# Altium schematic sheet 遥控2.SchDoc
size A4; SheetNumber: 1; SheetTotal: 1
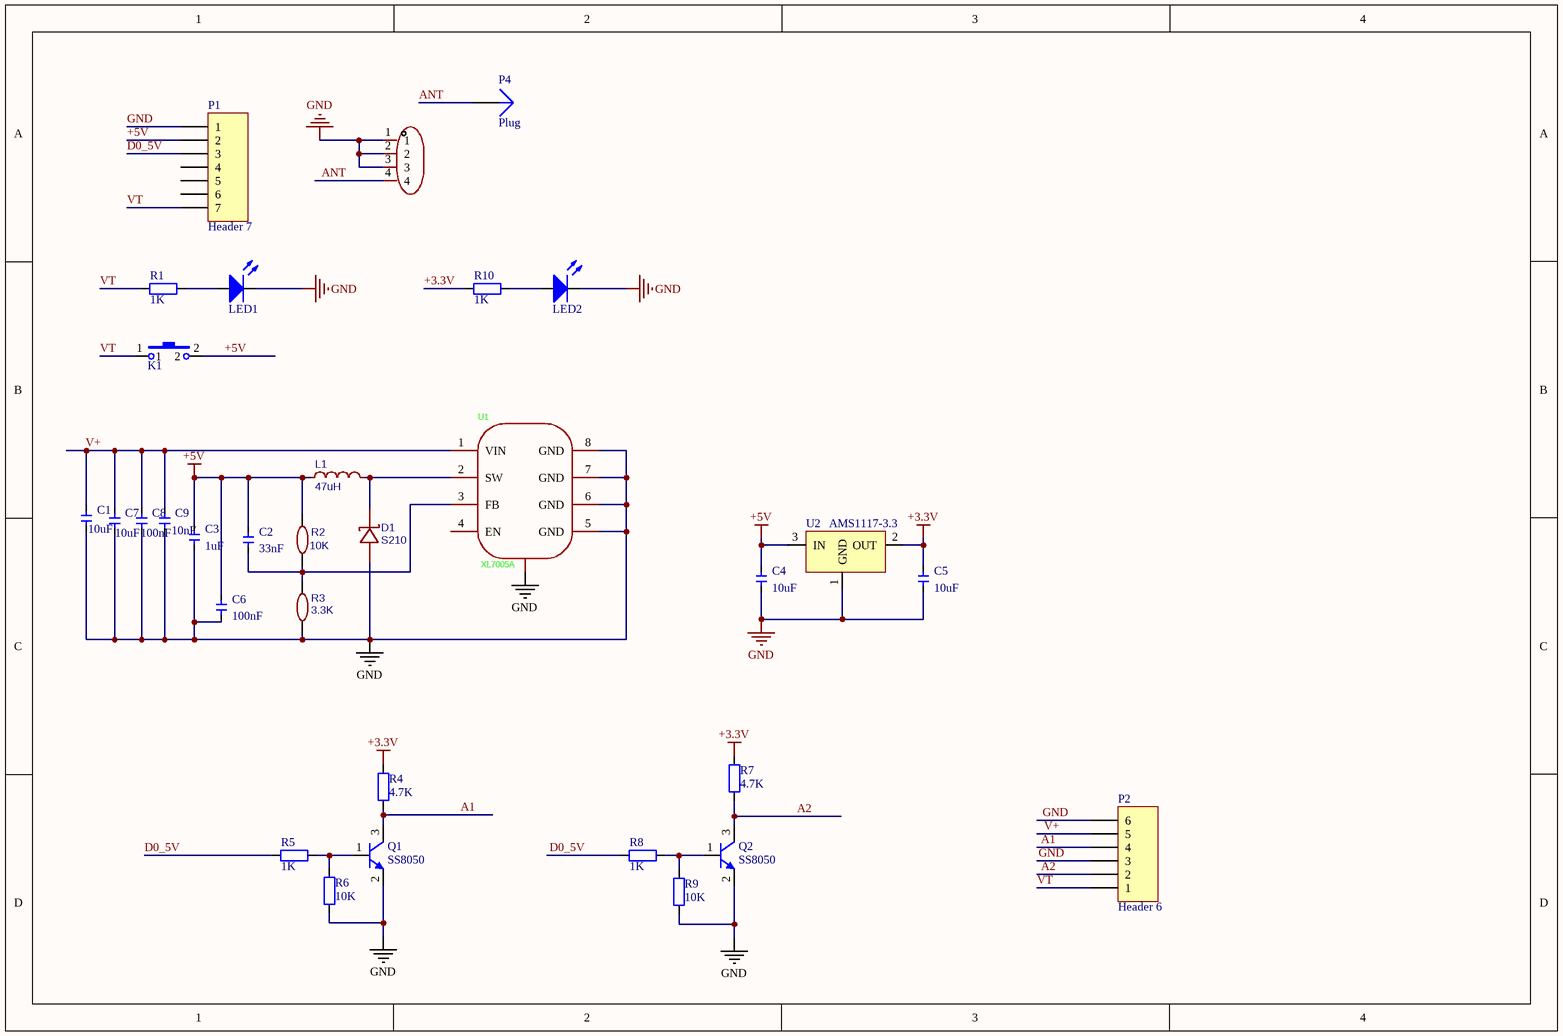
[diagram p0: 遥控2.SchDoc]

## Parts
C1  10uF  [0805]
C2  33nF  [CAP-0603]
C3  1uF  [CAP-0603]
C4  10uF  [CAP-0603]
C5  10uF  [CAP-0603]
C6  100nF  [CAP-0603]
C7  10uF  [0805]
C8  100nF  [0805]
C9  10nF  [0805]
D1  S210  [SOD-123]
K1  SW-PB  [SW-SMD_L3.9-W3.0-P4.45]  (value not drawn)
L1  47uH  [IND-SMD_L4.0-W4.0_FNR4012S]
LED1  LED  [LED_0805]  (value not drawn)
LED2  LED  [LED_0805]  (value not drawn)
P1  Header 7  [HDR1X7]
P2  Header 6  [HDR1X6]
P4  Plug  [HEADER_1]
Q1  SS8050  [SOT-23]
Q2  SS8050  [SOT-23]
R1  1K  [0603 - duplicate1]
R2  10K  [0603 - duplicate1]
R3  3.3K  [0603 - duplicate1]
R4  4.7K  [0603 - duplicate1]
R5  1K  [0603 - duplicate1]
R6  10K  [0603 - duplicate1]
R7  4.7K  [0603 - duplicate1]
R8  1K  [0603 - duplicate1]
R9  10K  [0603 - duplicate1]
R10  1K  [0603 - duplicate1]
RF1  6GHz  [CONN-SMD_GT-RF1125A-01G]  (value not drawn)
U1  XL7005A  [SOIC-8_L4.9-W3.9-P1.27-LS6.0-BL-EP3.1-1]
U2  AMS1117-3.3  [SOT89]

## Nets
+3.3V: C5.2 R4.1 R7.1 R10.2 U2.2(OUT)
+5V: C2.2 C3.2 C4.2 C6.2 K1.2 L1.1 P1.2 R2.2 U2.3(IN)
GND: C1.1 C3.1 C4.1 C5.1 C6.1 C7.1 C8.1 C9.1 D1.2(A) LED1.2(K) LED2.2(K) P1.1 P2.3 P2.6 Q1.2(E) Q2.2(E) R3.2 R6.1 R9.1 RF1.1 RF1.2 RF1.3 U1.5(GND) U1.6(GND) U1.7(GND) U1.8(GND) U1.9 U2.1(GND)
A1: P2.4 Q1.3(C) R4.2
A2: P2.2 Q2.3(C) R7.2
ANT: P4.1 RF1.4
D0_5V: P1.3 R5.1 R8.1
V+: C1.2 C7.2 C8.2 C9.2 P2.5 U1.1(VIN)
VT: K1.1 P1.7 P2.1 R1.2
NetC2_1: C2.1 R2.1 R3.1 U1.3(FB)
NetD1_1: D1.1(K) L1.2 U1.2(SW)
NetLED1_1: LED1.1(A) R1.1
NetLED2_1: LED2.1(A) R10.1
NetQ1_1: Q1.1(B) R5.2 R6.2
NetQ2_1: Q2.1(B) R8.2 R9.2

Not connected (* = marked no-connect by the designer): P1 4 5 6; U1 4(EN)

## Library data of the parts
C1-C9 = Cap: 无极性电容; Published: 8-Jun-2000; LatestRevisionDate: 17-Jul-2002; LatestRevisionNote: Re-released for DXP Platform.; PackageReference: RAD-0.3; Publisher: Altium Limited
D1 = B340A: Manufacturer: MDD; SMT Type: Extend; Supplier: LCSC; Manufacturer Part: B340A; image: //image.lceda.cn/szlcsc/C64982.jpg; Supplier Part: C64982; LCSC Assembly: Yes; spicePre: D; spiceSymbolName: B340A
K1 = SW-PB: 微动开关; Suppliter Part: C961737; Published: 24-Mar-1999; LatestRevisionDate: 17-Jul-2002; LatestRevisionNote: Re-released for DXP Platform.; PackageReference: SPST-2; Publisher: Altium Limited
L1 = 68uH: Manufacturer: SXN; Manufacturer Part: SMDRI127-680MT; nameAlias: Inductance; Supplier: LCSC; Supplier Part: C9907; spicePre: L; spiceSymbolName: SMDRI127-680MT
LED1 LED2 = LED: 发光二极管; Published: 8-Jun-2000; LatestRevisionDate: 08-Jul-2005; LatestRevisionNote: Mech Layer 1 removed.; PackageReference: LED-0; Publisher: Altium Limited
P1 = Header 7: Header, 7-Pin; LatestRevisionDate: 17-Jul-2002; LatestRevisionNote: Re-released for DXP Platform.; Publisher: Altium Limited
P2 = Header 6: Header, 6-Pin; LatestRevisionDate: 17-Jul-2002; LatestRevisionNote: Re-released for DXP Platform.; Publisher: Altium Limited
P4 = Plug: 安装孔; LatestRevisionDate: 17-Jul-2002; LatestRevisionNote: Re-released for DXP Platform.; Publisher: Altium Limited
Q1 Q2 = SS8050: NPN贴片三极管; Published: 8-Jun-2000; LatestRevisionDate: 15-Jan-2003; LatestRevisionNote: PCB Footprint 'BCY-W3/D4.7' replaced; DatasheetDocument: 1997; PackageDocument: Sep-1998; PackageReference: TO-92A; Publisher: Altium Limited; Code_JEDEC: TO-92A; ComponentLink1Description: Manufacturer Link; ComponentLink1URL: http://www.fairchildsemi.com/; ComponentLink2Description: Datasheet; ComponentLink2URL: http://www.fairchildsemi.com/ds/2N%2F2N3904.pdf
R1 R6 R9 R10 = Res: 贴片电阻; Published: 8-Jun-2000; LatestRevisionDate: 17-Jul-2002; LatestRevisionNote: Re-released for DXP Platform.; PackageReference: AXIAL-0.4; Publisher: Altium Limited
  R6 R9: Value: 10K
R2 = 1K: Manufacturer: UniOhm; Manufacturer Part: 0603WAF1001T5E; nameAlias: Resistance (Ohms); SMT Type: Basic; Supplier: LCSC; LCSC Assembly: Yes; Supplier Part: C21190; spicePre: R; spiceSymbolName: 0603WAF1001T5E
R3 = 3K: Manufacturer: UniOhm; Manufacturer Part: 0603WAF3001T5E; nameAlias: Resistance (Ohms); SMT Type: Basic; Supplier: LCSC; LCSC Assembly: Yes; Supplier Part: C4211; spicePre: R; spiceSymbolName: 0603WAF3001T5E
R4 R5 R7 R8 = Res: 贴片电阻; Value: 10K; Published: 8-Jun-2000; LatestRevisionDate: 17-Jul-2002; LatestRevisionNote: Re-released for DXP Platform.; PackageReference: AXIAL-0.4; Publisher: Altium Limited
RF1 = GT-RF1125A-01G: Manufacturer: G-Switch(品赞); Add into BOM: yes; Connector Type: 板端; Interface: 内针; Number of Ports: 1; Interface Diameter: 2mm; Interface Length/Height: 1.25mm; RF Series: IPEX; Impedance: 20mΩ; Style: 立贴; Symbol: GT-RF1125A-01G; Device: GT-RF1125A-01G; LCSC Part Name: 内针 IPEX 立贴; Supplier Part: C5299419; Manufacturer Part: GT-RF1125A-01G; Supplier Footprint: SMD; JLCPCB Part Class: Extended Part; Datasheet: https://atta.szlcsc.com/upload/public/pdf/source/20240806/E29158DC2BBCFBE0FBB4FF318E1913A6.pdf; Supplier: LCSC; Convert to PCB: yes; Value: 6GHz; Operating Temperature Range: -40℃~+90℃
U1 = XL7005A: Manufacturer: XLSEMI(芯龙); Add into BOM: yes; Function: 降压型; Output Type: 可调; Voltage - Supply: 5V~80V; Output Voltage: 1.25V~20V; Output Current: 400mA; Frequency - Switching: 150kHz; Synchronous Rectifier: 否; Number of Outputs: 1; Topology: 降压式; Quiescent Current: 2.5mA; Switch tube (built-in/external): 内置; Symbol: XL7005A; Device: XL7005A; LCSC Part Name: 0.4A 150kHz 80V 降压型DC-DC转换器; Supplier Part: C50848; Manufacturer Part: XL7005A; Supplier Footprint: SOIC-8-EP; JLCPCB Part Class: Extended Part; Datasheet: https://atta.szlcsc.com/upload/public/pdf/source/20150821/1457707346919.pdf; Supplier: LCSC; Convert to PCB: yes; Operating Temperature: -40℃~+125℃@(TJ)
U2 = AMS1117: 3.3V稳压芯片